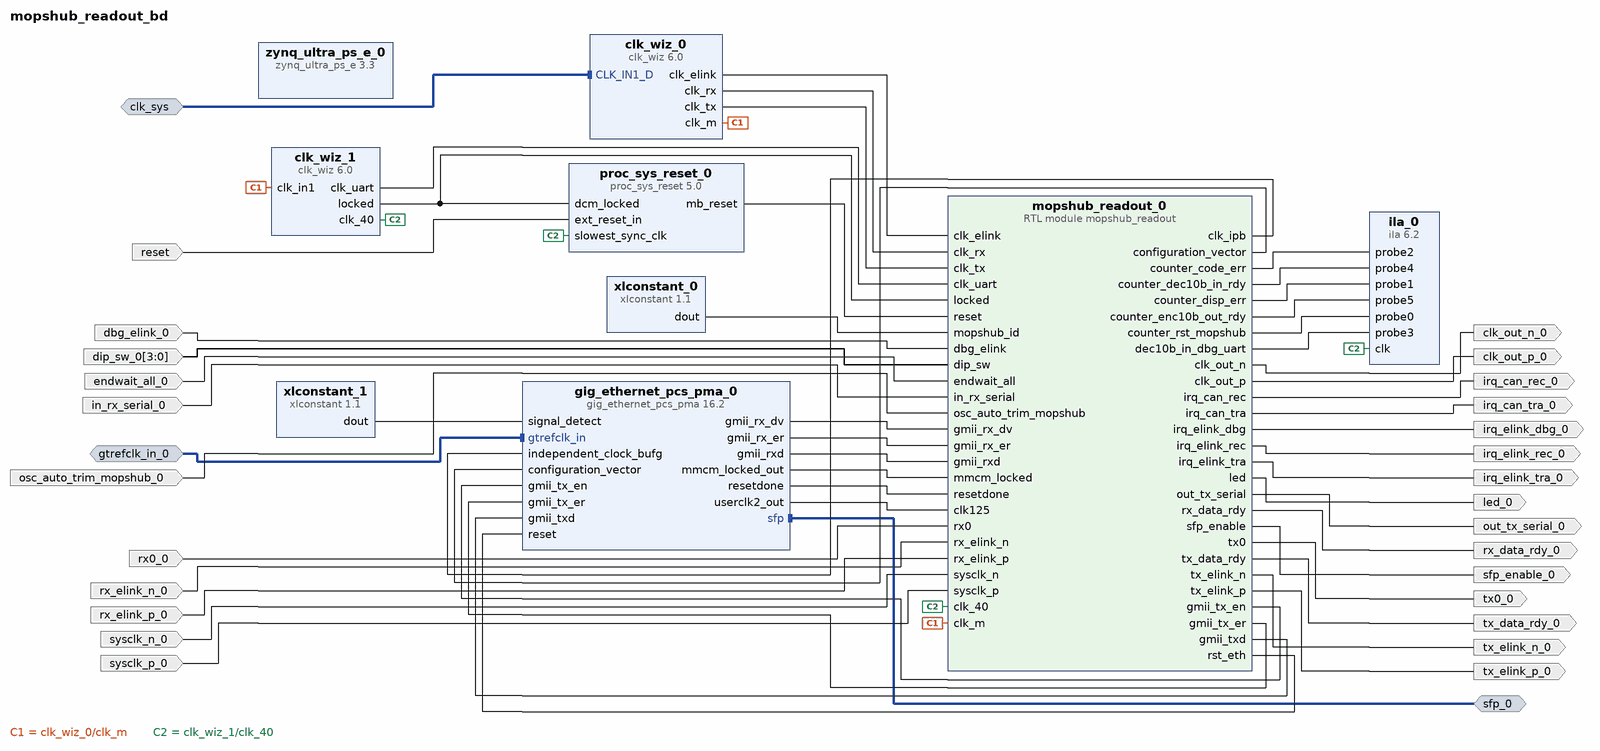
[diagram p0: block diagram of the top level]
# Vivado block design mopshub_readout_bd, xczu9eg-ffvb1156-2-e, Vivado 2020.2
create_bd_design mopshub_readout_bd

create_bd_intf_port -mode Slave -vlnv xilinx.com:interface:diff_clock_rtl:1.0 clk_sys
set_property -dict {CONFIG.FREQ_HZ 300000000} [get_bd_intf_ports clk_sys]
create_bd_intf_port -mode Slave -vlnv xilinx.com:interface:diff_clock_rtl:1.0 gtrefclk_in_0
create_bd_intf_port -mode Master -vlnv xilinx.com:interface:sfp_rtl:1.0 sfp_0
create_bd_port -dir O clk_out_n_0
create_bd_port -dir O clk_out_p_0
create_bd_port -dir I dbg_elink_0
create_bd_port -dir I -from 3 -to 0 dip_sw_0
create_bd_port -dir I endwait_all_0
create_bd_port -dir I in_rx_serial_0
create_bd_port -dir O irq_can_rec_0
create_bd_port -dir O irq_can_tra_0
create_bd_port -dir O irq_elink_dbg_0
create_bd_port -dir O irq_elink_rec_0
create_bd_port -dir O irq_elink_tra_0
create_bd_port -dir O led_0
create_bd_port -dir I osc_auto_trim_mopshub_0
create_bd_port -dir O out_tx_serial_0
create_bd_port -dir I -type rst reset
set_property -dict {CONFIG.POLARITY ACTIVE_HIGH} [get_bd_ports reset]
create_bd_port -dir I rx0_0
create_bd_port -dir O rx_data_rdy_0
create_bd_port -dir I rx_elink_n_0
create_bd_port -dir I rx_elink_p_0
create_bd_port -dir O sfp_enable_0
create_bd_port -dir I sysclk_n_0
create_bd_port -dir I sysclk_p_0
create_bd_port -dir O tx0_0
create_bd_port -dir O tx_data_rdy_0
create_bd_port -dir O tx_elink_n_0
create_bd_port -dir O tx_elink_p_0

create_bd_cell -type ip -vlnv xilinx.com:ip:clk_wiz:6.0 clk_wiz_0
set_property -dict [list \
  CONFIG.CLKIN1_JITTER_PS 33.330000000000005 \
  CONFIG.CLKOUT1_DRIVES BUFGCE \
  CONFIG.CLKOUT1_JITTER 218.961 \
  CONFIG.CLKOUT1_MATCHED_ROUTING false \
  CONFIG.CLKOUT1_PHASE_ERROR 303.392 \
  CONFIG.CLKOUT1_REQUESTED_OUT_FREQ 80 \
  CONFIG.CLKOUT1_USED true \
  CONFIG.CLKOUT2_DRIVES BUFGCE \
  CONFIG.CLKOUT2_JITTER 198.987 \
  CONFIG.CLKOUT2_MATCHED_ROUTING false \
  CONFIG.CLKOUT2_PHASE_ERROR 303.392 \
  CONFIG.CLKOUT2_REQUESTED_OUT_FREQ 160 \
  CONFIG.CLKOUT2_USED true \
  CONFIG.CLKOUT3_DRIVES BUFGCE \
  CONFIG.CLKOUT3_JITTER 241.384 \
  CONFIG.CLKOUT3_MATCHED_ROUTING false \
  CONFIG.CLKOUT3_PHASE_ERROR 303.392 \
  CONFIG.CLKOUT3_REQUESTED_OUT_FREQ 40 \
  CONFIG.CLKOUT3_USED true \
  CONFIG.CLKOUT4_DRIVES BUFGCE \
  CONFIG.CLKOUT4_JITTER 218.961 \
  CONFIG.CLKOUT4_MATCHED_ROUTING false \
  CONFIG.CLKOUT4_PHASE_ERROR 303.392 \
  CONFIG.CLKOUT4_REQUESTED_OUT_FREQ 80.000 \
  CONFIG.CLKOUT4_USED true \
  CONFIG.CLKOUT5_DRIVES BUFGCE \
  CONFIG.CLKOUT5_JITTER 116.326 \
  CONFIG.CLKOUT5_PHASE_ERROR 95.014 \
  CONFIG.CLKOUT5_REQUESTED_OUT_FREQ 100.000 \
  CONFIG.CLKOUT5_USED false \
  CONFIG.CLKOUT6_DRIVES BUFGCE \
  CONFIG.CLKOUT6_JITTER 99.826 \
  CONFIG.CLKOUT6_PHASE_ERROR 102.732 \
  CONFIG.CLKOUT6_REQUESTED_OUT_FREQ 100.000 \
  CONFIG.CLKOUT6_USED false \
  CONFIG.CLKOUT7_DRIVES BUFGCE \
  CONFIG.CLK_IN1_BOARD_INTERFACE user_si570_sysclk \
  CONFIG.CLK_IN2_BOARD_INTERFACE Custom \
  CONFIG.CLK_OUT1_PORT clk_tx \
  CONFIG.CLK_OUT2_PORT clk_rx \
  CONFIG.CLK_OUT3_PORT clk_elink \
  CONFIG.CLK_OUT4_PORT clk_m \
  CONFIG.CLK_OUT5_PORT clk_out5 \
  CONFIG.CLK_OUT6_PORT clk_out6 \
  CONFIG.FEEDBACK_SOURCE FDBK_AUTO \
  CONFIG.MMCM_CLKFBOUT_MULT_F 56.000 \
  CONFIG.MMCM_CLKIN1_PERIOD 3.333 \
  CONFIG.MMCM_CLKIN2_PERIOD 10.0 \
  CONFIG.MMCM_CLKOUT0_DIVIDE_F 14.000 \
  CONFIG.MMCM_CLKOUT1_DIVIDE 7 \
  CONFIG.MMCM_CLKOUT2_DIVIDE 28 \
  CONFIG.MMCM_CLKOUT3_DIVIDE 14 \
  CONFIG.MMCM_CLKOUT4_DIVIDE 1 \
  CONFIG.MMCM_CLKOUT5_DIVIDE 1 \
  CONFIG.MMCM_DIVCLK_DIVIDE 15 \
  CONFIG.MMCM_STARTUP_WAIT false \
  CONFIG.NUM_OUT_CLKS 4 \
  CONFIG.OVERRIDE_MMCM false \
  CONFIG.PHASESHIFT_MODE LATENCY \
  CONFIG.PRIM_IN_FREQ 300.000 \
  CONFIG.PRIM_SOURCE Differential_clock_capable_pin \
  CONFIG.RESET_BOARD_INTERFACE reset \
  CONFIG.SECONDARY_SOURCE Single_ended_clock_capable_pin \
  CONFIG.USE_BOARD_FLOW true \
  CONFIG.USE_LOCKED false \
  CONFIG.USE_PHASE_ALIGNMENT true \
  CONFIG.USE_RESET false \
  CONFIG.USE_SAFE_CLOCK_STARTUP true \
] [get_bd_cells clk_wiz_0]
create_bd_cell -type ip -vlnv xilinx.com:ip:clk_wiz:6.0 clk_wiz_1
set_property -dict [list \
  CONFIG.AUTO_PRIMITIVE MMCM \
  CONFIG.CLKIN1_JITTER_PS 125.0 \
  CONFIG.CLKOUT1_DRIVES Buffer \
  CONFIG.CLKOUT1_JITTER 195.690 \
  CONFIG.CLKOUT1_PHASE_ERROR 92.039 \
  CONFIG.CLKOUT1_REQUESTED_OUT_FREQ 11.53846 \
  CONFIG.CLKOUT2_DRIVES Buffer \
  CONFIG.CLKOUT2_JITTER 143.874 \
  CONFIG.CLKOUT2_PHASE_ERROR 92.039 \
  CONFIG.CLKOUT2_REQUESTED_OUT_FREQ 40 \
  CONFIG.CLKOUT2_USED true \
  CONFIG.CLKOUT3_DRIVES Buffer \
  CONFIG.CLKOUT4_DRIVES Buffer \
  CONFIG.CLKOUT5_DRIVES Buffer \
  CONFIG.CLKOUT6_DRIVES Buffer \
  CONFIG.CLKOUT7_DRIVES Buffer \
  CONFIG.CLK_IN1_BOARD_INTERFACE Custom \
  CONFIG.CLK_OUT1_PORT clk_uart \
  CONFIG.CLK_OUT2_PORT clk_40 \
  CONFIG.FEEDBACK_SOURCE FDBK_AUTO \
  CONFIG.MMCM_BANDWIDTH OPTIMIZED \
  CONFIG.MMCM_CLKFBOUT_MULT_F 15.000 \
  CONFIG.MMCM_CLKIN1_PERIOD 12.500 \
  CONFIG.MMCM_CLKIN2_PERIOD 10.000 \
  CONFIG.MMCM_CLKOUT0_DIVIDE_F 104.000 \
  CONFIG.MMCM_CLKOUT1_DIVIDE 30 \
  CONFIG.MMCM_COMPENSATION AUTO \
  CONFIG.MMCM_DIVCLK_DIVIDE 1 \
  CONFIG.NUM_OUT_CLKS 2 \
  CONFIG.PHASESHIFT_MODE WAVEFORM \
  CONFIG.PRIMITIVE Auto \
  CONFIG.PRIM_IN_FREQ 80.000 \
  CONFIG.PRIM_SOURCE Single_ended_clock_capable_pin \
  CONFIG.SECONDARY_SOURCE Single_ended_clock_capable_pin \
  CONFIG.USE_BOARD_FLOW true \
  CONFIG.USE_LOCKED true \
  CONFIG.USE_PHASE_ALIGNMENT true \
  CONFIG.USE_RESET false \
] [get_bd_cells clk_wiz_1]
create_bd_cell -type ip -vlnv xilinx.com:ip:gig_ethernet_pcs_pma:16.2 gig_ethernet_pcs_pma_0
set_property -dict [list \
  CONFIG.Auto_Negotiation false \
  CONFIG.DrpClkRate 31.25 \
  CONFIG.GT_Location X1Y14 \
  CONFIG.Management_Interface false \
  CONFIG.RefClkRate 156.25 \
  CONFIG.SupportLevel Include_Shared_Logic_in_Core \
] [get_bd_cells gig_ethernet_pcs_pma_0]
create_bd_cell -type ip -vlnv xilinx.com:ip:ila:6.2 ila_0
set_property -dict [list \
  CONFIG.C_ENABLE_ILA_AXI_MON false \
  CONFIG.C_MONITOR_TYPE Native \
  CONFIG.C_NUM_OF_PROBES 6 \
  CONFIG.C_PROBE0_WIDTH 8 \
  CONFIG.C_PROBE1_WIDTH 8 \
  CONFIG.C_PROBE2_WIDTH 8 \
  CONFIG.C_PROBE3_WIDTH 8 \
] [get_bd_cells ila_0]
create_bd_cell -type ip -vlnv xilinx.com:ip:proc_sys_reset:5.0 proc_sys_reset_0
set_property -dict [list \
  CONFIG.C_AUX_RST_WIDTH 1 \
  CONFIG.C_EXT_RST_WIDTH 1 \
  CONFIG.RESET_BOARD_INTERFACE reset \
  CONFIG.USE_BOARD_FLOW true \
] [get_bd_cells proc_sys_reset_0]
create_bd_cell -type ip -vlnv xilinx.com:ip:xlconstant:1.1 xlconstant_0
set_property -dict {CONFIG.CONST_VAL 2 CONFIG.CONST_WIDTH 4} [get_bd_cells xlconstant_0]
create_bd_cell -type ip -vlnv xilinx.com:ip:xlconstant:1.1 xlconstant_1
create_bd_cell -type ip -vlnv xilinx.com:ip:zynq_ultra_ps_e:3.3 zynq_ultra_ps_e_0
set_property -dict [list \
  CONFIG.CAN0_BOARD_INTERFACE custom \
  CONFIG.CAN1_BOARD_INTERFACE custom \
  CONFIG.CSU_BOARD_INTERFACE custom \
  CONFIG.DP_BOARD_INTERFACE custom \
  CONFIG.GEM0_BOARD_INTERFACE custom \
  CONFIG.GEM1_BOARD_INTERFACE custom \
  CONFIG.GEM2_BOARD_INTERFACE custom \
  CONFIG.GEM3_BOARD_INTERFACE custom \
  CONFIG.GPIO_BOARD_INTERFACE custom \
  CONFIG.IIC0_BOARD_INTERFACE custom \
  CONFIG.IIC1_BOARD_INTERFACE custom \
  CONFIG.NAND_BOARD_INTERFACE custom \
  CONFIG.PCIE_BOARD_INTERFACE custom \
  CONFIG.PJTAG_BOARD_INTERFACE custom \
  CONFIG.PMU_BOARD_INTERFACE custom \
  CONFIG.PSU_BANK_0_IO_STANDARD LVCMOS18 \
  CONFIG.PSU_BANK_1_IO_STANDARD LVCMOS18 \
  CONFIG.PSU_BANK_2_IO_STANDARD LVCMOS18 \
  CONFIG.PSU_BANK_3_IO_STANDARD LVCMOS18 \
  CONFIG.PSU_DYNAMIC_DDR_CONFIG_EN 1 \
  CONFIG.PSU_USB3__DUAL_CLOCK_ENABLE 1 \
  CONFIG.PSU__CAN1__PERIPHERAL__ENABLE 1 \
  CONFIG.PSU__CAN1__PERIPHERAL__IO {MIO 24 .. 25} \
  CONFIG.PSU__CRF_APB__ACPU_CTRL__FREQMHZ 1200 \
  CONFIG.PSU__CRF_APB__ACPU_CTRL__SRCSEL APLL \
  CONFIG.PSU__CRF_APB__APLL_CTRL__SRCSEL PSS_REF_CLK \
  CONFIG.PSU__CRF_APB__DBG_FPD_CTRL__FREQMHZ 250 \
  CONFIG.PSU__CRF_APB__DBG_FPD_CTRL__SRCSEL IOPLL \
  CONFIG.PSU__CRF_APB__DBG_TRACE_CTRL__FREQMHZ 250 \
  CONFIG.PSU__CRF_APB__DBG_TRACE_CTRL__SRCSEL IOPLL \
  CONFIG.PSU__CRF_APB__DBG_TSTMP_CTRL__FREQMHZ 250 \
  CONFIG.PSU__CRF_APB__DBG_TSTMP_CTRL__SRCSEL IOPLL \
  CONFIG.PSU__CRF_APB__DDR_CTRL__FREQMHZ 1067 \
  CONFIG.PSU__CRF_APB__DDR_CTRL__SRCSEL DPLL \
  CONFIG.PSU__CRF_APB__DPDMA_REF_CTRL__FREQMHZ 600 \
  CONFIG.PSU__CRF_APB__DPDMA_REF_CTRL__SRCSEL APLL \
  CONFIG.PSU__CRF_APB__DPLL_CTRL__SRCSEL PSS_REF_CLK \
  CONFIG.PSU__CRF_APB__DP_AUDIO_REF_CTRL__SRCSEL RPLL \
  CONFIG.PSU__CRF_APB__DP_STC_REF_CTRL__SRCSEL RPLL \
  CONFIG.PSU__CRF_APB__DP_VIDEO_REF_CTRL__SRCSEL VPLL \
  CONFIG.PSU__CRF_APB__GDMA_REF_CTRL__FREQMHZ 600 \
  CONFIG.PSU__CRF_APB__GDMA_REF_CTRL__SRCSEL APLL \
  CONFIG.PSU__CRF_APB__GPU_REF_CTRL__FREQMHZ 500 \
  CONFIG.PSU__CRF_APB__GPU_REF_CTRL__SRCSEL IOPLL \
  CONFIG.PSU__CRF_APB__TOPSW_LSBUS_CTRL__FREQMHZ 100 \
  CONFIG.PSU__CRF_APB__TOPSW_LSBUS_CTRL__SRCSEL IOPLL \
  CONFIG.PSU__CRF_APB__TOPSW_MAIN_CTRL__FREQMHZ 533.33 \
  CONFIG.PSU__CRF_APB__TOPSW_MAIN_CTRL__SRCSEL DPLL \
  CONFIG.PSU__CRF_APB__VPLL_CTRL__SRCSEL PSS_REF_CLK \
  CONFIG.PSU__CRL_APB__ADMA_REF_CTRL__FREQMHZ 500 \
  CONFIG.PSU__CRL_APB__ADMA_REF_CTRL__SRCSEL IOPLL \
  CONFIG.PSU__CRL_APB__CAN1_REF_CTRL__FREQMHZ 100 \
  CONFIG.PSU__CRL_APB__CAN1_REF_CTRL__SRCSEL IOPLL \
  CONFIG.PSU__CRL_APB__CPU_R5_CTRL__FREQMHZ 500 \
  CONFIG.PSU__CRL_APB__CPU_R5_CTRL__SRCSEL IOPLL \
  CONFIG.PSU__CRL_APB__DBG_LPD_CTRL__FREQMHZ 250 \
  CONFIG.PSU__CRL_APB__DBG_LPD_CTRL__SRCSEL IOPLL \
  CONFIG.PSU__CRL_APB__GEM3_REF_CTRL__FREQMHZ 125 \
  CONFIG.PSU__CRL_APB__GEM3_REF_CTRL__SRCSEL IOPLL \
  CONFIG.PSU__CRL_APB__I2C0_REF_CTRL__FREQMHZ 100 \
  CONFIG.PSU__CRL_APB__I2C0_REF_CTRL__SRCSEL IOPLL \
  CONFIG.PSU__CRL_APB__I2C1_REF_CTRL__FREQMHZ 100 \
  CONFIG.PSU__CRL_APB__I2C1_REF_CTRL__SRCSEL IOPLL \
  CONFIG.PSU__CRL_APB__IOPLL_CTRL__SRCSEL PSS_REF_CLK \
  CONFIG.PSU__CRL_APB__IOU_SWITCH_CTRL__FREQMHZ 250 \
  CONFIG.PSU__CRL_APB__IOU_SWITCH_CTRL__SRCSEL IOPLL \
  CONFIG.PSU__CRL_APB__LPD_LSBUS_CTRL__FREQMHZ 100 \
  CONFIG.PSU__CRL_APB__LPD_LSBUS_CTRL__SRCSEL IOPLL \
  CONFIG.PSU__CRL_APB__LPD_SWITCH_CTRL__FREQMHZ 500 \
  CONFIG.PSU__CRL_APB__LPD_SWITCH_CTRL__SRCSEL IOPLL \
  CONFIG.PSU__CRL_APB__PCAP_CTRL__FREQMHZ 200 \
  CONFIG.PSU__CRL_APB__PCAP_CTRL__SRCSEL IOPLL \
  CONFIG.PSU__CRL_APB__QSPI_REF_CTRL__FREQMHZ 125 \
  CONFIG.PSU__CRL_APB__QSPI_REF_CTRL__SRCSEL IOPLL \
  CONFIG.PSU__CRL_APB__RPLL_CTRL__SRCSEL PSS_REF_CLK \
  CONFIG.PSU__CRL_APB__SDIO1_REF_CTRL__FREQMHZ 200 \
  CONFIG.PSU__CRL_APB__SDIO1_REF_CTRL__SRCSEL IOPLL \
  CONFIG.PSU__CRL_APB__TIMESTAMP_REF_CTRL__FREQMHZ 100 \
  CONFIG.PSU__CRL_APB__TIMESTAMP_REF_CTRL__SRCSEL IOPLL \
  CONFIG.PSU__CRL_APB__UART0_REF_CTRL__FREQMHZ 100 \
  CONFIG.PSU__CRL_APB__UART0_REF_CTRL__SRCSEL IOPLL \
  CONFIG.PSU__CRL_APB__UART1_REF_CTRL__FREQMHZ 100 \
  CONFIG.PSU__CRL_APB__UART1_REF_CTRL__SRCSEL IOPLL \
  CONFIG.PSU__CRL_APB__USB0_BUS_REF_CTRL__FREQMHZ 250 \
  CONFIG.PSU__CRL_APB__USB0_BUS_REF_CTRL__SRCSEL IOPLL \
  CONFIG.PSU__CRL_APB__USB3_DUAL_REF_CTRL__FREQMHZ 20 \
  CONFIG.PSU__CRL_APB__USB3_DUAL_REF_CTRL__SRCSEL IOPLL \
  CONFIG.PSU__CRL_APB__USB3__ENABLE 1 \
  CONFIG.PSU__CSUPMU__PERIPHERAL__VALID 1 \
  CONFIG.PSU__DDRC__BUS_WIDTH {64 Bit} \
  CONFIG.PSU__DDRC__COMPONENTS UDIMM \
  CONFIG.PSU__DDRC__DEVICE_CAPACITY {4096 MBits} \
  CONFIG.PSU__DDRC__DRAM_WIDTH {8 Bits} \
  CONFIG.PSU__DDRC__ECC Disabled \
  CONFIG.PSU__DDRC__MEMORY_TYPE {DDR 4} \
  CONFIG.PSU__DDRC__SPEED_BIN DDR4_2133P \
  CONFIG.PSU__DDR_HIGH_ADDRESS_GUI_ENABLE 1 \
  CONFIG.PSU__DDR__INTERFACE__FREQMHZ 533.500 \
  CONFIG.PSU__DEVICE_TYPE EG \
  CONFIG.PSU__DISPLAYPORT__LANE0__ENABLE 1 \
  CONFIG.PSU__DISPLAYPORT__LANE0__IO {GT Lane1} \
  CONFIG.PSU__DISPLAYPORT__LANE1__ENABLE 0 \
  CONFIG.PSU__DISPLAYPORT__PERIPHERAL__ENABLE 1 \
  CONFIG.PSU__DLL__ISUSED 1 \
  CONFIG.PSU__DPAUX__PERIPHERAL__ENABLE 1 \
  CONFIG.PSU__DPAUX__PERIPHERAL__IO {MIO 27 .. 30} \
  CONFIG.PSU__DP__LANE_SEL {Single Lower} \
  CONFIG.PSU__DP__REF_CLK_FREQ 27 \
  CONFIG.PSU__DP__REF_CLK_SEL {Ref Clk3} \
  CONFIG.PSU__ENET3__FIFO__ENABLE 0 \
  CONFIG.PSU__ENET3__GRP_MDIO__ENABLE 1 \
  CONFIG.PSU__ENET3__GRP_MDIO__IO {MIO 76 .. 77} \
  CONFIG.PSU__ENET3__PERIPHERAL__ENABLE 1 \
  CONFIG.PSU__ENET3__PERIPHERAL__IO {MIO 64 .. 75} \
  CONFIG.PSU__ENET3__PTP__ENABLE 0 \
  CONFIG.PSU__ENET3__TSU__ENABLE 0 \
  CONFIG.PSU__FPGA_PL0_ENABLE 0 \
  CONFIG.PSU__GEM3_COHERENCY 0 \
  CONFIG.PSU__GEM3_ROUTE_THROUGH_FPD 0 \
  CONFIG.PSU__GEM__TSU__ENABLE 0 \
  CONFIG.PSU__GPIO0_MIO__IO {MIO 0 .. 25} \
  CONFIG.PSU__GPIO0_MIO__PERIPHERAL__ENABLE 1 \
  CONFIG.PSU__GPIO1_MIO__IO {MIO 26 .. 51} \
  CONFIG.PSU__GPIO1_MIO__PERIPHERAL__ENABLE 1 \
  CONFIG.PSU__GPIO_EMIO_WIDTH 96 \
  CONFIG.PSU__GPIO_EMIO__WIDTH {[95:0]} \
  CONFIG.PSU__GT__LINK_SPEED HBR \
  CONFIG.PSU__GT__PRE_EMPH_LVL_4 0 \
  CONFIG.PSU__GT__VLT_SWNG_LVL_4 0 \
  CONFIG.PSU__I2C0__PERIPHERAL__ENABLE 1 \
  CONFIG.PSU__I2C0__PERIPHERAL__IO {MIO 14 .. 15} \
  CONFIG.PSU__I2C1__PERIPHERAL__ENABLE 1 \
  CONFIG.PSU__I2C1__PERIPHERAL__IO {MIO 16 .. 17} \
  CONFIG.PSU__IOU_SLCR__IOU_TTC_APB_CLK__TTC0_SEL APB \
  CONFIG.PSU__IOU_SLCR__IOU_TTC_APB_CLK__TTC1_SEL APB \
  CONFIG.PSU__IOU_SLCR__IOU_TTC_APB_CLK__TTC2_SEL APB \
  CONFIG.PSU__IOU_SLCR__IOU_TTC_APB_CLK__TTC3_SEL APB \
  CONFIG.PSU__OVERRIDE_HPX_QOS 0 \
  CONFIG.PSU__OVERRIDE__BASIC_CLOCK 0 \
  CONFIG.PSU__PCIE__BAR0_VAL 0x0 \
  CONFIG.PSU__PCIE__BAR1_VAL 0x0 \
  CONFIG.PSU__PCIE__BAR2_VAL 0x0 \
  CONFIG.PSU__PCIE__BAR3_VAL 0x0 \
  CONFIG.PSU__PCIE__BAR4_VAL 0x0 \
  CONFIG.PSU__PCIE__BAR5_VAL 0x0 \
  CONFIG.PSU__PCIE__CLASS_CODE_BASE 0x06 \
  CONFIG.PSU__PCIE__CLASS_CODE_INTERFACE 0x0 \
  CONFIG.PSU__PCIE__CLASS_CODE_SUB 0x4 \
  CONFIG.PSU__PCIE__CLASS_CODE_VALUE 0x60400 \
  CONFIG.PSU__PCIE__CRS_SW_VISIBILITY 1 \
  CONFIG.PSU__PCIE__DEVICE_ID 0xD021 \
  CONFIG.PSU__PCIE__DEVICE_PORT_TYPE {Root Port} \
  CONFIG.PSU__PCIE__EROM_VAL 0x0 \
  CONFIG.PSU__PCIE__LANE0__ENABLE 1 \
  CONFIG.PSU__PCIE__LANE0__IO {GT Lane0} \
  CONFIG.PSU__PCIE__LINK_SPEED {5.0 Gb/s} \
  CONFIG.PSU__PCIE__MAXIMUM_LINK_WIDTH x1 \
  CONFIG.PSU__PCIE__MAX_PAYLOAD_SIZE {256 bytes} \
  CONFIG.PSU__PCIE__PERIPHERAL__ENABLE 1 \
  CONFIG.PSU__PCIE__PERIPHERAL__ENDPOINT_ENABLE 0 \
  CONFIG.PSU__PCIE__PERIPHERAL__ROOTPORT_ENABLE 1 \
  CONFIG.PSU__PCIE__PERIPHERAL__ROOTPORT_IO {MIO 31} \
  CONFIG.PSU__PCIE__REF_CLK_FREQ 100 \
  CONFIG.PSU__PCIE__REF_CLK_SEL {Ref Clk0} \
  CONFIG.PSU__PCIE__REVISION_ID 0x0 \
  CONFIG.PSU__PCIE__SUBSYSTEM_ID 0x7 \
  CONFIG.PSU__PCIE__SUBSYSTEM_VENDOR_ID 0x10EE \
  CONFIG.PSU__PCIE__VENDOR_ID 0x10EE \
  CONFIG.PSU__PMU_COHERENCY 0 \
  CONFIG.PSU__PMU__AIBACK__ENABLE 0 \
  CONFIG.PSU__PMU__EMIO_GPI__ENABLE 0 \
  CONFIG.PSU__PMU__EMIO_GPO__ENABLE 0 \
  CONFIG.PSU__PMU__GPI0__ENABLE 0 \
  CONFIG.PSU__PMU__GPI1__ENABLE 0 \
  CONFIG.PSU__PMU__GPI2__ENABLE 0 \
  CONFIG.PSU__PMU__GPI3__ENABLE 0 \
  CONFIG.PSU__PMU__GPI4__ENABLE 0 \
  CONFIG.PSU__PMU__GPI5__ENABLE 0 \
  CONFIG.PSU__PMU__GPO0__ENABLE 1 \
  CONFIG.PSU__PMU__GPO0__IO {MIO 32} \
  CONFIG.PSU__PMU__GPO1__ENABLE 1 \
  CONFIG.PSU__PMU__GPO1__IO {MIO 33} \
  CONFIG.PSU__PMU__GPO2__ENABLE 1 \
  CONFIG.PSU__PMU__GPO2__IO {MIO 34} \
  CONFIG.PSU__PMU__GPO2__POLARITY high \
  CONFIG.PSU__PMU__GPO3__ENABLE 1 \
  CONFIG.PSU__PMU__GPO3__IO {MIO 35} \
  CONFIG.PSU__PMU__GPO3__POLARITY low \
  CONFIG.PSU__PMU__GPO4__ENABLE 1 \
  CONFIG.PSU__PMU__GPO4__IO {MIO 36} \
  CONFIG.PSU__PMU__GPO4__POLARITY low \
  CONFIG.PSU__PMU__GPO5__ENABLE 1 \
  CONFIG.PSU__PMU__GPO5__IO {MIO 37} \
  CONFIG.PSU__PMU__GPO5__POLARITY low \
  CONFIG.PSU__PMU__PERIPHERAL__ENABLE 1 \
  CONFIG.PSU__PMU__PLERROR__ENABLE 0 \
  CONFIG.PSU__PRESET_APPLIED 1 \
  CONFIG.PSU__PSS_REF_CLK__FREQMHZ 33.330 \
  CONFIG.PSU__QSPI_COHERENCY 0 \
  CONFIG.PSU__QSPI_ROUTE_THROUGH_FPD 0 \
  CONFIG.PSU__QSPI__GRP_FBCLK__ENABLE 1 \
  CONFIG.PSU__QSPI__GRP_FBCLK__IO {MIO 6} \
  CONFIG.PSU__QSPI__PERIPHERAL__DATA_MODE x4 \
  CONFIG.PSU__QSPI__PERIPHERAL__ENABLE 1 \
  CONFIG.PSU__QSPI__PERIPHERAL__IO {MIO 0 .. 5} \
  CONFIG.PSU__QSPI__PERIPHERAL__MODE Single \
  CONFIG.PSU__SATA__LANE1__IO {GT Lane3} \
  CONFIG.PSU__SATA__PERIPHERAL__ENABLE 1 \
  CONFIG.PSU__SATA__REF_CLK_FREQ 125 \
  CONFIG.PSU__SATA__REF_CLK_SEL {Ref Clk1} \
  CONFIG.PSU__SD1_COHERENCY 0 \
  CONFIG.PSU__SD1_ROUTE_THROUGH_FPD 0 \
  CONFIG.PSU__SD1__DATA_TRANSFER_MODE 8Bit \
  CONFIG.PSU__SD1__GRP_CD__ENABLE 1 \
  CONFIG.PSU__SD1__GRP_CD__IO {MIO 45} \
  CONFIG.PSU__SD1__GRP_POW__ENABLE 0 \
  CONFIG.PSU__SD1__GRP_WP__ENABLE 1 \
  CONFIG.PSU__SD1__GRP_WP__IO {MIO 44} \
  CONFIG.PSU__SD1__PERIPHERAL__ENABLE 1 \
  CONFIG.PSU__SD1__PERIPHERAL__IO {MIO 39 .. 51} \
  CONFIG.PSU__SD1__SLOT_TYPE {SD 3.0} \
  CONFIG.PSU__SWDT0__CLOCK__ENABLE 0 \
  CONFIG.PSU__SWDT0__PERIPHERAL__ENABLE 1 \
  CONFIG.PSU__SWDT0__RESET__ENABLE 0 \
  CONFIG.PSU__SWDT1__CLOCK__ENABLE 0 \
  CONFIG.PSU__SWDT1__PERIPHERAL__ENABLE 1 \
  CONFIG.PSU__SWDT1__RESET__ENABLE 0 \
  CONFIG.PSU__TSU__BUFG_PORT_PAIR 0 \
  CONFIG.PSU__TTC0__CLOCK__ENABLE 0 \
  CONFIG.PSU__TTC0__PERIPHERAL__ENABLE 1 \
  CONFIG.PSU__TTC0__WAVEOUT__ENABLE 0 \
  CONFIG.PSU__TTC1__CLOCK__ENABLE 0 \
  CONFIG.PSU__TTC1__PERIPHERAL__ENABLE 1 \
  CONFIG.PSU__TTC1__WAVEOUT__ENABLE 0 \
  CONFIG.PSU__TTC2__CLOCK__ENABLE 0 \
  CONFIG.PSU__TTC2__PERIPHERAL__ENABLE 1 \
  CONFIG.PSU__TTC2__WAVEOUT__ENABLE 0 \
  CONFIG.PSU__TTC3__CLOCK__ENABLE 0 \
  CONFIG.PSU__TTC3__PERIPHERAL__ENABLE 1 \
  CONFIG.PSU__TTC3__WAVEOUT__ENABLE 0 \
  CONFIG.PSU__UART0__BAUD_RATE 115200 \
  CONFIG.PSU__UART0__MODEM__ENABLE 0 \
  CONFIG.PSU__UART0__PERIPHERAL__ENABLE 1 \
  CONFIG.PSU__UART0__PERIPHERAL__IO {MIO 18 .. 19} \
  CONFIG.PSU__UART1__BAUD_RATE 115200 \
  CONFIG.PSU__UART1__MODEM__ENABLE 0 \
  CONFIG.PSU__UART1__PERIPHERAL__ENABLE 1 \
  CONFIG.PSU__UART1__PERIPHERAL__IO {MIO 20 .. 21} \
  CONFIG.PSU__USB0_COHERENCY 0 \
  CONFIG.PSU__USB0__PERIPHERAL__ENABLE 1 \
  CONFIG.PSU__USB0__PERIPHERAL__IO {MIO 52 .. 63} \
  CONFIG.PSU__USB0__REF_CLK_FREQ 26 \
  CONFIG.PSU__USB0__REF_CLK_SEL {Ref Clk2} \
  CONFIG.PSU__USB2_0__EMIO__ENABLE 0 \
  CONFIG.PSU__USB3_0__EMIO__ENABLE 0 \
  CONFIG.PSU__USB3_0__PERIPHERAL__ENABLE 1 \
  CONFIG.PSU__USB3_0__PERIPHERAL__IO {GT Lane2} \
  CONFIG.PSU__USB__RESET__MODE {Boot Pin} \
  CONFIG.PSU__USB__RESET__POLARITY {Active Low} \
  CONFIG.PSU__USE__FABRIC__RST 0 \
  CONFIG.PSU__USE__IRQ0 0 \
  CONFIG.PSU__USE__M_AXI_GP0 0 \
  CONFIG.PSU__USE__M_AXI_GP1 0 \
  CONFIG.PSU__USE__M_AXI_GP2 0 \
  CONFIG.QSPI_BOARD_INTERFACE custom \
  CONFIG.SATA_BOARD_INTERFACE custom \
  CONFIG.SD0_BOARD_INTERFACE custom \
  CONFIG.SD1_BOARD_INTERFACE custom \
  CONFIG.SPI0_BOARD_INTERFACE custom \
  CONFIG.SPI1_BOARD_INTERFACE custom \
  CONFIG.SUBPRESET1 Custom \
  CONFIG.SUBPRESET2 Custom \
  CONFIG.SWDT0_BOARD_INTERFACE custom \
  CONFIG.SWDT1_BOARD_INTERFACE custom \
  CONFIG.TRACE_BOARD_INTERFACE custom \
  CONFIG.TTC0_BOARD_INTERFACE custom \
  CONFIG.TTC1_BOARD_INTERFACE custom \
  CONFIG.TTC2_BOARD_INTERFACE custom \
  CONFIG.TTC3_BOARD_INTERFACE custom \
  CONFIG.UART0_BOARD_INTERFACE custom \
  CONFIG.UART1_BOARD_INTERFACE custom \
  CONFIG.USB0_BOARD_INTERFACE custom \
  CONFIG.USB1_BOARD_INTERFACE custom \
] [get_bd_cells zynq_ultra_ps_e_0]
# 729 more settings of zynq_ultra_ps_e_0 are not shown: defaults, MIO pin electricals, DDR timing, and values the tool derives
create_bd_cell -type module -reference mopshub_readout mopshub_readout_0

# ---- connections ----

connect_bd_intf_net -intf_net gtrefclk_in_0_1 [get_bd_intf_ports gtrefclk_in_0] [get_bd_intf_pins gig_ethernet_pcs_pma_0/gtrefclk_in]
connect_bd_intf_net -intf_net user_si570_sysclk_1 [get_bd_intf_ports clk_sys] [get_bd_intf_pins clk_wiz_0/CLK_IN1_D]
connect_bd_intf_net [get_bd_intf_ports sfp_0] [get_bd_intf_pins gig_ethernet_pcs_pma_0/sfp]
connect_bd_net [get_bd_pins clk_wiz_0/clk_elink] [get_bd_pins mopshub_readout_0/clk_elink]
connect_bd_net [get_bd_pins clk_wiz_0/clk_m] [get_bd_pins clk_wiz_1/clk_in1] [get_bd_pins mopshub_readout_0/clk_m]
connect_bd_net [get_bd_pins clk_wiz_0/clk_rx] [get_bd_pins mopshub_readout_0/clk_rx]
connect_bd_net [get_bd_pins clk_wiz_0/clk_tx] [get_bd_pins mopshub_readout_0/clk_tx]
connect_bd_net [get_bd_pins clk_wiz_1/clk_40] \
  [get_bd_pins ila_0/clk] [get_bd_pins proc_sys_reset_0/slowest_sync_clk] [get_bd_pins mopshub_readout_0/clk_40]
connect_bd_net [get_bd_pins clk_wiz_1/clk_uart] [get_bd_pins mopshub_readout_0/clk_uart]
connect_bd_net [get_bd_pins clk_wiz_1/locked] [get_bd_pins proc_sys_reset_0/dcm_locked] [get_bd_pins mopshub_readout_0/locked]
connect_bd_net -net dbg_elink_0_1 [get_bd_ports dbg_elink_0] [get_bd_pins mopshub_readout_0/dbg_elink]
connect_bd_net -net dip_sw_0_1 [get_bd_ports dip_sw_0] [get_bd_pins mopshub_readout_0/dip_sw]
connect_bd_net -net endwait_all_0_1 [get_bd_ports endwait_all_0] [get_bd_pins mopshub_readout_0/endwait_all]
connect_bd_net -net ext_reset_in_0_1 [get_bd_ports reset] [get_bd_pins proc_sys_reset_0/ext_reset_in]
connect_bd_net [get_bd_pins gig_ethernet_pcs_pma_0/gmii_rx_dv] [get_bd_pins mopshub_readout_0/gmii_rx_dv]
connect_bd_net [get_bd_pins gig_ethernet_pcs_pma_0/gmii_rx_er] [get_bd_pins mopshub_readout_0/gmii_rx_er]
connect_bd_net [get_bd_pins gig_ethernet_pcs_pma_0/gmii_rxd] [get_bd_pins mopshub_readout_0/gmii_rxd]
connect_bd_net [get_bd_pins gig_ethernet_pcs_pma_0/mmcm_locked_out] [get_bd_pins mopshub_readout_0/mmcm_locked]
connect_bd_net [get_bd_pins gig_ethernet_pcs_pma_0/resetdone] [get_bd_pins mopshub_readout_0/resetdone]
connect_bd_net [get_bd_pins gig_ethernet_pcs_pma_0/userclk2_out] [get_bd_pins mopshub_readout_0/clk125]
connect_bd_net -net in_rx_serial_0_1 [get_bd_ports in_rx_serial_0] [get_bd_pins mopshub_readout_0/in_rx_serial]
connect_bd_net [get_bd_pins mopshub_readout_0/clk_ipb] [get_bd_pins gig_ethernet_pcs_pma_0/independent_clock_bufg]
connect_bd_net [get_bd_pins mopshub_readout_0/clk_out_n] [get_bd_ports clk_out_n_0]
connect_bd_net [get_bd_pins mopshub_readout_0/clk_out_p] [get_bd_ports clk_out_p_0]
connect_bd_net [get_bd_pins mopshub_readout_0/configuration_vector] [get_bd_pins gig_ethernet_pcs_pma_0/configuration_vector]
connect_bd_net [get_bd_pins mopshub_readout_0/counter_code_err] [get_bd_pins ila_0/probe2]
connect_bd_net [get_bd_pins mopshub_readout_0/counter_dec10b_in_rdy] [get_bd_pins ila_0/probe4]
connect_bd_net [get_bd_pins mopshub_readout_0/counter_disp_err] [get_bd_pins ila_0/probe1]
connect_bd_net [get_bd_pins mopshub_readout_0/counter_enc10b_out_rdy] [get_bd_pins ila_0/probe5]
connect_bd_net [get_bd_pins mopshub_readout_0/counter_rst_mopshub] [get_bd_pins ila_0/probe0]
connect_bd_net [get_bd_pins mopshub_readout_0/dec10b_in_dbg_uart] [get_bd_pins ila_0/probe3]
connect_bd_net [get_bd_pins mopshub_readout_0/gmii_tx_en] [get_bd_pins gig_ethernet_pcs_pma_0/gmii_tx_en]
connect_bd_net [get_bd_pins mopshub_readout_0/gmii_tx_er] [get_bd_pins gig_ethernet_pcs_pma_0/gmii_tx_er]
connect_bd_net [get_bd_pins mopshub_readout_0/gmii_txd] [get_bd_pins gig_ethernet_pcs_pma_0/gmii_txd]
connect_bd_net [get_bd_pins mopshub_readout_0/irq_can_rec] [get_bd_ports irq_can_rec_0]
connect_bd_net [get_bd_pins mopshub_readout_0/irq_can_tra] [get_bd_ports irq_can_tra_0]
connect_bd_net [get_bd_pins mopshub_readout_0/irq_elink_dbg] [get_bd_ports irq_elink_dbg_0]
connect_bd_net [get_bd_pins mopshub_readout_0/irq_elink_rec] [get_bd_ports irq_elink_rec_0]
connect_bd_net [get_bd_pins mopshub_readout_0/irq_elink_tra] [get_bd_ports irq_elink_tra_0]
connect_bd_net [get_bd_pins mopshub_readout_0/led] [get_bd_ports led_0]
connect_bd_net [get_bd_pins mopshub_readout_0/out_tx_serial] [get_bd_ports out_tx_serial_0]
connect_bd_net [get_bd_pins mopshub_readout_0/rst_eth] [get_bd_pins gig_ethernet_pcs_pma_0/reset]
connect_bd_net [get_bd_pins mopshub_readout_0/rx_data_rdy] [get_bd_ports rx_data_rdy_0]
connect_bd_net [get_bd_pins mopshub_readout_0/sfp_enable] [get_bd_ports sfp_enable_0]
connect_bd_net [get_bd_pins mopshub_readout_0/tx0] [get_bd_ports tx0_0]
connect_bd_net [get_bd_pins mopshub_readout_0/tx_data_rdy] [get_bd_ports tx_data_rdy_0]
connect_bd_net [get_bd_pins mopshub_readout_0/tx_elink_n] [get_bd_ports tx_elink_n_0]
connect_bd_net [get_bd_pins mopshub_readout_0/tx_elink_p] [get_bd_ports tx_elink_p_0]
connect_bd_net -net osc_auto_trim_mopshub_0_1 [get_bd_ports osc_auto_trim_mopshub_0] [get_bd_pins mopshub_readout_0/osc_auto_trim_mopshub]
connect_bd_net [get_bd_pins proc_sys_reset_0/mb_reset] [get_bd_pins mopshub_readout_0/reset]
connect_bd_net -net rx0_0_1 [get_bd_ports rx0_0] [get_bd_pins mopshub_readout_0/rx0]
connect_bd_net -net rx_elink_n_0_1 [get_bd_ports rx_elink_n_0] [get_bd_pins mopshub_readout_0/rx_elink_n]
connect_bd_net -net rx_elink_p_0_1 [get_bd_ports rx_elink_p_0] [get_bd_pins mopshub_readout_0/rx_elink_p]
connect_bd_net -net sysclk_n_0_1 [get_bd_ports sysclk_n_0] [get_bd_pins mopshub_readout_0/sysclk_n]
connect_bd_net -net sysclk_p_0_1 [get_bd_ports sysclk_p_0] [get_bd_pins mopshub_readout_0/sysclk_p]
connect_bd_net [get_bd_pins xlconstant_0/dout] [get_bd_pins mopshub_readout_0/mopshub_id]
connect_bd_net [get_bd_pins xlconstant_1/dout] [get_bd_pins gig_ethernet_pcs_pma_0/signal_detect]
set_property PFM.CLOCK {pl_clk0 {id "4" is_default "false" proc_sys_reset "" status "fixed"}} [get_bd_cells zynq_ultra_ps_e_0]

validate_bd_design
save_bd_design
